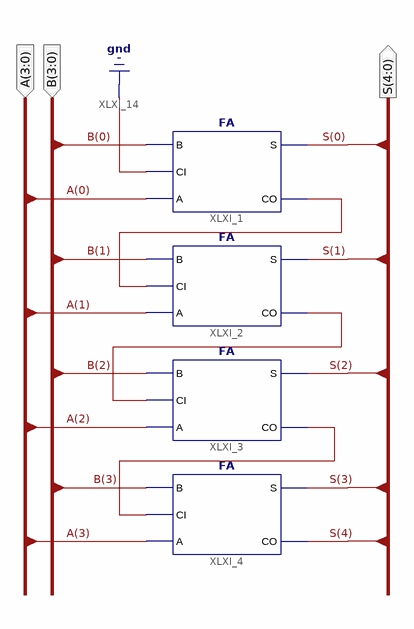
[diagram p0: schematic sheet 1]
// Xilinx ISE schematic Adder.sch (spartan3) as structural Verilog: 4 symbols, 3 ports
module Adder (
  input  [3:0] A,
  input  [3:0] B,
  output [4:0] S
);

  wire XLXN_9, XLXN_10, XLXN_11;

  FA XLXI_1 (.B(B[0]), .CI(1'b0), .A(A[0]), .S(S[0]), .CO(XLXN_9));
  FA XLXI_2 (.B(B[1]), .CI(XLXN_9), .A(A[1]), .S(S[1]), .CO(XLXN_10));
  FA XLXI_4 (.B(B[3]), .CI(XLXN_11), .A(A[3]), .S(S[3]), .CO(S[4]));
  FA XLXI_3 (.B(B[2]), .CI(XLXN_10), .A(A[2]), .S(S[2]), .CO(XLXN_11));
endmodule
